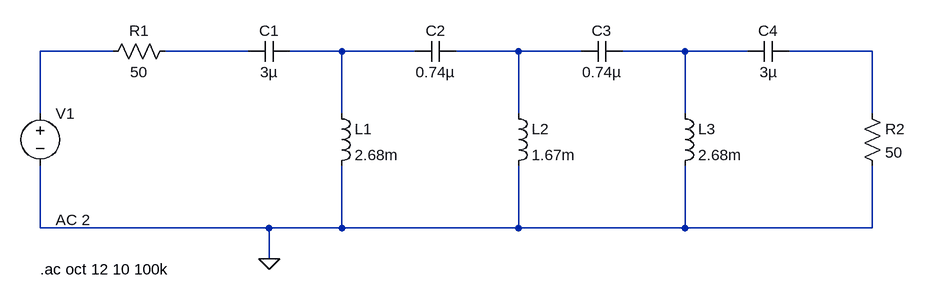
[diagram p0: schematic Draft3 Highpass Butter.asc]
Draft3 Highpass Butter.asc, the LTspice schematic file:
Version 4.1
SHEET 1 1976 680
WIRE 240 0 128 0
WIRE 448 0 320 0
WIRE 592 0 512 0
WIRE 704 0 592 0
WIRE 864 0 768 0
WIRE 960 0 864 0
WIRE 1120 0 1024 0
WIRE 1216 0 1120 0
WIRE 1408 0 1280 0
WIRE 128 96 128 0
WIRE 592 96 592 0
WIRE 864 96 864 0
WIRE 1120 96 1120 0
WIRE 1408 96 1408 0
WIRE 128 272 128 176
WIRE 480 272 128 272
WIRE 592 272 592 176
WIRE 592 272 480 272
WIRE 864 272 864 176
WIRE 864 272 592 272
WIRE 1120 272 1120 176
WIRE 1120 272 864 272
WIRE 1408 272 1408 176
WIRE 1408 272 1120 272
WIRE 480 320 480 272
FLAG 480 320 0
SYMBOL voltage 128 80 R0
WINDOW 3 24 152 Left 2
WINDOW 123 24 180 Left 2
WINDOW 39 0 0 Left 0
SYMATTR Value ""
SYMATTR Value2 AC 2
SYMATTR InstName V1
SYMBOL res 336 -16 R90
WINDOW 0 0 56 VBottom 2
WINDOW 3 32 56 VTop 2
SYMATTR InstName R1
SYMATTR Value 50
SYMBOL res 1392 80 R0
SYMATTR InstName R2
SYMATTR Value 50
SYMBOL cap 512 -16 R90
WINDOW 0 0 32 VBottom 2
WINDOW 3 32 32 VTop 2
SYMATTR InstName C1
SYMATTR Value 3µ
SYMBOL cap 768 -16 R90
WINDOW 0 0 32 VBottom 2
WINDOW 3 32 32 VTop 2
SYMATTR InstName C2
SYMATTR Value 0.74µ
SYMBOL cap 1024 -16 R90
WINDOW 0 0 32 VBottom 2
WINDOW 3 32 32 VTop 2
SYMATTR InstName C3
SYMATTR Value 0.74µ
SYMBOL cap 1280 -16 R90
WINDOW 0 0 32 VBottom 2
WINDOW 3 32 32 VTop 2
SYMATTR InstName C4
SYMATTR Value 3µ
SYMBOL ind 576 80 R0
SYMATTR InstName L1
SYMATTR Value 2.68m
SYMBOL ind 848 80 R0
SYMATTR InstName L2
SYMATTR Value 1.67m
SYMBOL ind 1104 80 R0
SYMATTR InstName L3
SYMATTR Value 2.68m
TEXT 128 336 Left 2 !.ac oct 12 10 100k

The netlist it stands for:
* Draft3 Highpass Butter.asc
V1 N001 0 AC 2
R1 N002 N001 50
R2 N006 0 50
C1 N003 N002 3µ
C2 N004 N003 0.74µ
C3 N005 N004 0.74µ
C4 N006 N005 3µ
L1 N003 0 2.68m
L2 N004 0 1.67m
L3 N005 0 2.68m
.ac oct 12 10 100k
.backanno
.end